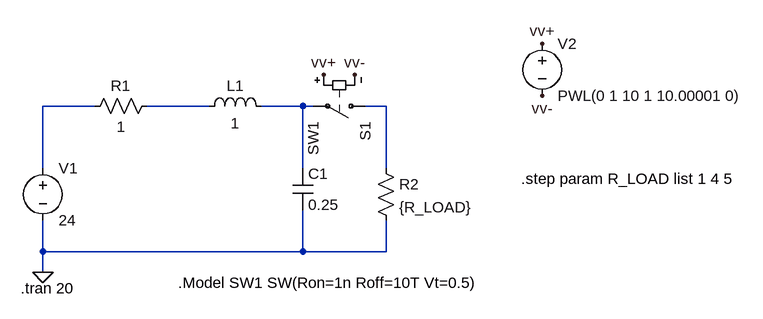
[diagram p0: schematic ex-8.7.asc]
ex-8.7.asc, the LTspice schematic file:
Version 4
SHEET 1 1196 680
WIRE 176 48 96 48
WIRE 352 48 256 48
WIRE 496 48 432 48
WIRE 512 48 496 48
WIRE 624 48 592 48
WIRE 96 144 96 48
WIRE 496 144 496 48
WIRE 624 144 624 48
WIRE 96 272 96 224
WIRE 496 272 496 208
WIRE 496 272 96 272
WIRE 624 272 624 224
WIRE 624 272 496 272
WIRE 96 304 96 272
FLAG 96 304 0
FLAG 528 0 vv+
FLAG 864 -48 vv+
FLAG 576 0 vv-
FLAG 864 32 vv-
SYMBOL voltage 96 128 R0
WINDOW 123 0 0 Left 0
WINDOW 39 0 0 Left 0
SYMATTR InstName V1
SYMATTR Value 24
SYMBOL res 272 32 R90
WINDOW 0 0 56 VBottom 2
WINDOW 3 32 56 VTop 2
SYMATTR InstName R1
SYMATTR Value 1
SYMBOL ind 336 64 R270
WINDOW 0 32 56 VTop 2
WINDOW 3 5 56 VBottom 2
SYMATTR InstName L1
SYMATTR Value 1
SYMBOL res 608 128 R0
SYMATTR InstName R2
SYMATTR Value {R_LOAD}
SYMBOL cap 480 144 R0
SYMATTR InstName C1
SYMATTR Value 0.25
SYMBOL sw 608 48 R90
SYMATTR InstName S1
SYMATTR Value SW1
SYMBOL voltage 864 -64 R0
WINDOW 123 0 0 Left 0
WINDOW 39 0 0 Left 0
SYMATTR InstName V2
SYMATTR Value PWL(0 1 10 1 10.00001 0)
TEXT 62 328 Left 2 !.tran 20
TEXT 304 320 Left 2 !.Model SW1 SW(Ron=1n Roff=10T Vt=0.5)
TEXT 832 160 Left 2 !.step param R_LOAD list 1 4 5

The netlist it stands for:
* ex-8.7.asc
V1 N001 0 24
R1 N002 N001 1
L1 N002 N003 1
R2 N004 0 {R_LOAD}
C1 N003 0 0.25
S1 N004 N003 vv+ vv- SW1
V2 vv+ vv- PWL(0 1 10 1 10.00001 0)
.tran 20
.Model SW1 SW(Ron=1n Roff=10T Vt=0.5)
.step param R_LOAD list 1 4 5
.backanno
.end